# EAGLE schematic NoteGenerator (EAGLE 9.6.2)
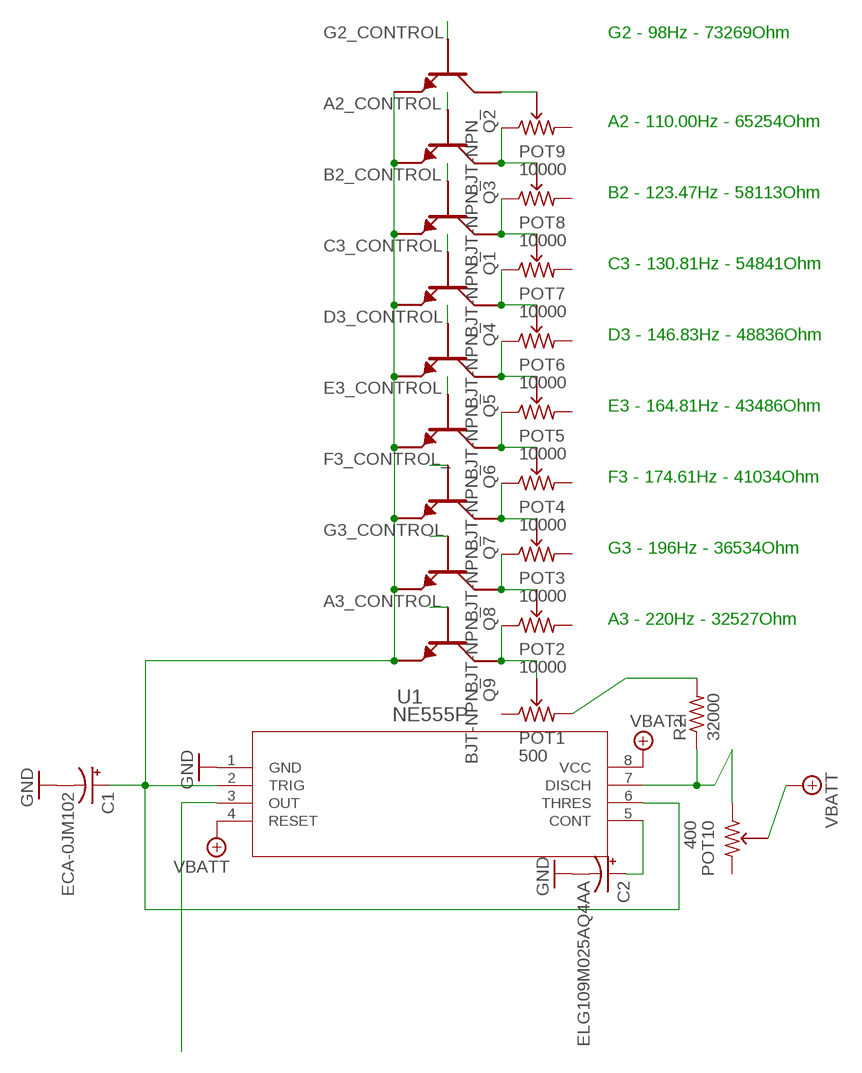
[diagram p0: schematic, sheet 1]

## Parts
C1  ECA-0JM102  [PCAP_8X112]
C2  ELG109M025AQ4AA  [PCAP_8X112]
POT1  500  PVG3  [PVG3G]
POT2  10000  PVG3  [PVG3G]
POT3  10000  PVG3  [PVG3G]
POT4  10000  PVG3  [PVG3G]
POT5  10000  PVG3  [PVG3G]
POT6  10000  PVG3  [PVG3G]
POT7  10000  PVG3  [PVG3G]
POT8  10000  PVG3  [PVG3G]
POT9  10000  PVG3  [PVG3G]
POT10  400  PVG3  [PVG3G]
Q1  BJT-NPN_  [SOT-23-3]
Q2  BJT-NPN_  [SOT-23-3]
Q3  BJT-NPN_  [SOT-23-3]
Q4  BJT-NPN_  [SOT-23-3]
Q5  BJT-NPN_  [SOT-23-3]
Q6  BJT-NPN_  [SOT-23-3]
Q7  BJT-NPN_  [SOT-23-3]
Q8  BJT-NPN_  [SOT-23-3]
Q9  BJT-NPN_  [SOT-23-3]
R2  32000  ERJ-L06KF50MV  [RC0805N]
U1  NE555P  [P8]

## Nets
A2_CONTROL: Q3.1(B)
A3_CONTROL: Q9.1(B)
B2_CONTROL: Q1.1(B)
C3_CONTROL: Q4.1(B)
D3_CONTROL: Q5.1(B)
E3_CONTROL: Q6.1(B)
F3_CONTROL_: Q7.1(B)
G2_CONTROL: Q2.1(B)
G3_CONTROL: Q8.1(B)
GND: C1.2(-) C2.2(-) U1.1(GND)
N$1: POT10.1(PIN1) R2.1(PIN1) U1.7(DISCH)
N$2: POT1.3(PIN3) R2.2(PIN2)
N$3: C2.1(+) U1.5(CONT)
N$4: U1.3(OUT)
N$5: POT4.2(PIN2) POT5.1(PIN1) Q6.3(C)
N$6: POT5.2(PIN2) POT6.1(PIN1) Q5.3(C)
N$7: POT6.2(PIN2) POT7.1(PIN1) Q4.3(C)
N$8: POT7.2(PIN2) POT8.1(PIN1) Q1.3(C)
N$9: POT8.2(PIN2) POT9.1(PIN1) Q3.3(C)
N$10: POT9.2(PIN2) Q2.3(C)
N$11: C1.1(+) Q1.2(E) Q2.2(E) Q3.2(E) Q4.2(E) Q5.2(E) Q6.2(E) Q7.2(E) Q8.2(E) Q9.2(E) U1.2(TRIG) U1.6(THRES)
N$12: POT3.2(PIN2) POT4.1(PIN1) Q7.3(C)
N$13: POT1.2(PIN2) POT2.1(PIN1) Q9.3(C)
N$14: POT2.2(PIN2) POT3.1(PIN1) Q8.3(C)
VBATT: POT10.2(PIN2) U1.4(RESET) U1.8(VCC)
Unconnected: POT1.1(PIN1) POT2.3(PIN3) POT3.3(PIN3) POT4.3(PIN3) POT5.3(PIN3) POT6.3(PIN3) POT7.3(PIN3) POT8.3(PIN3) POT9.3(PIN3) POT10.3(PIN3)

## Notes on the sheet
- G2 - 98Hz - 73269Ohm
- A2 - 110.00Hz - 65254Ohm
- B2 - 123.47Hz - 58113Ohm
- C3 - 130.81Hz - 54841Ohm
- D3 - 146.83Hz - 48836Ohm
- E3 - 164.81Hz - 43486Ohm
- F3 - 174.61Hz - 41034Ohm
- G3 - 196Hz - 36534Ohm
- A3 - 220Hz - 32527Ohm

## Library data of the parts
C1 = RoboJackets-Capacitors:ECA-0JM102: https://www.digikey.com/product-detail/en/panasonic-electronic-components/ECA-0JM102/P5115-ND/244974; MANUFACTURER_PART_NUMBER: ECA0JM102; VENDOR: Panasonic
C2 = PCB_Challenge_Custom:ELG109M025AQ4AA: https://www.digikey.com/en/products/detail/kemet/ELG109M025AQ4AA/13177666 0.01µF 25V Aluminum Electrolytic Capacitors; MANUFACTURER_PART_NUMBER: ECA0JM102; VENDOR: Panasonic
POT1 = RoboJackets-Resistors:PVG3*: 500 Ohms 0.25W, 1/4W Gull Wing Surface Mount Trimmer Potentiometer Cermet 1 Turn Top Adjustment; DKPN: PVG3G501C01R00CT-ND; POWER: 0.25W; TOLERANCE: ±20%
POT2-POT10 = RoboJackets-Resistors:PVG3*: 500 Ohms 0.25W, 1/4W Gull Wing Surface Mount Trimmer Potentiometer Cermet 1 Turn Top Adjustment; DKPN: PVG3G501C01R00CT-ND; POWER: 0.25W; TOLERANCE: ±20%; VALUE: 500
Q1-Q9 = RoboJackets-Discrete:BJT-NPN_*
R2 = RoboJackets-Resistors:ERJ-L06KF50MV: Current Sensing Resistor Datasheet <https://industrial.panasonic.com/cdbs/www-data/pdf/RDN0000/AOA0000C313.pdf>; DKPN: P50LLCT-ND
U1 = PCB_Challenge_Custom:NE555P; DATASHEET_URL: http://www.ti.com/lit/gpn/NE555; DESCRIPTION: Single Precision Timer; FAMILY_NAME: TIMERS(CT); GENERIC_PART_NUMBER: NE555; INDUSTRY_STD_PKG_TYPE: PDIP; MANUFACTURER: Texas Instruments; PACKAGE_DESIGNATOR: P; PIN_COUNT: 8